# Altium schematic sheet Keyboard.SchDoc
size A3; SheetNumber: 2; SheetTotal: 4
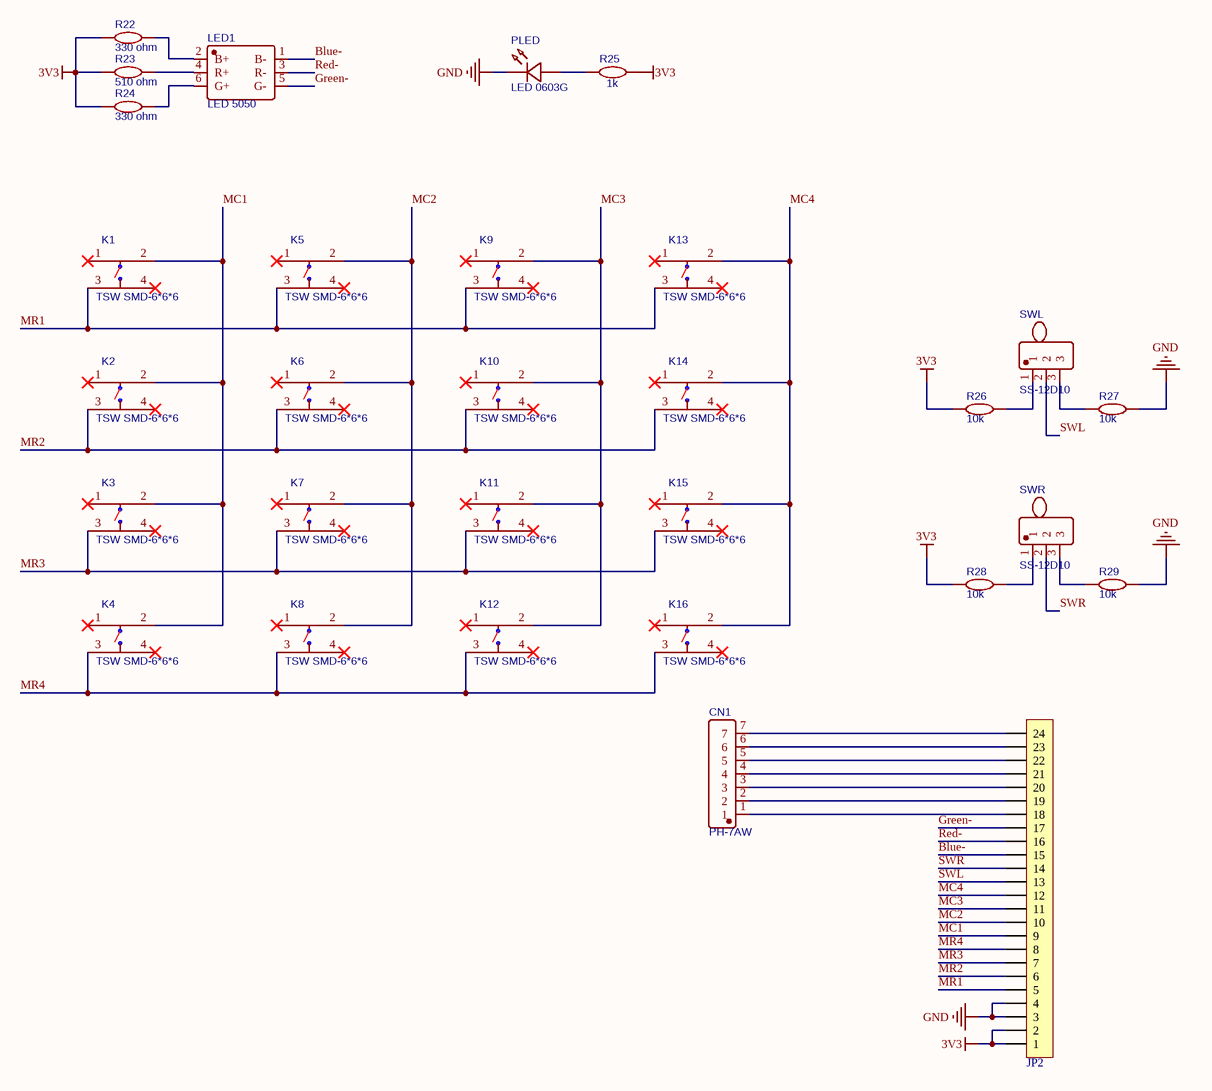
[diagram p0: Keyboard.SchDoc]

## Parts
CN1  PH-7AW  [CONN-TH_PH-7AW]
JP2  FPC1.0-24P  [FPC1.0-2H-WS-24P]  (value not drawn)
K1  TSW SMD-6*6*6  [TSW SMD-6*6*6]
K2  TSW SMD-6*6*6  [TSW SMD-6*6*6]
K3  TSW SMD-6*6*6  [TSW SMD-6*6*6]
K4  TSW SMD-6*6*6  [TSW SMD-6*6*6]
K5  TSW SMD-6*6*6  [TSW SMD-6*6*6]
K6  TSW SMD-6*6*6  [TSW SMD-6*6*6]
K7  TSW SMD-6*6*6  [TSW SMD-6*6*6]
K8  TSW SMD-6*6*6  [TSW SMD-6*6*6]
K9  TSW SMD-6*6*6  [TSW SMD-6*6*6]
K10  TSW SMD-6*6*6  [TSW SMD-6*6*6]
K11  TSW SMD-6*6*6  [TSW SMD-6*6*6]
K12  TSW SMD-6*6*6  [TSW SMD-6*6*6]
K13  TSW SMD-6*6*6  [TSW SMD-6*6*6]
K14  TSW SMD-6*6*6  [TSW SMD-6*6*6]
K15  TSW SMD-6*6*6  [TSW SMD-6*6*6]
K16  TSW SMD-6*6*6  [TSW SMD-6*6*6]
LED1  LED 5050  [LED 5050]
PLED  LED 0603G  [LED 0603G]
R22  330 ohm  [R0603]
R23  510 ohm  [R0603]
R24  330 ohm  [R0603]
R25  1k  [R0603]
R26  10k  [R0603]
R27  10k  [R0603]
R28  10k  [R0603]
R29  10k  [R0603]
SWL  SS-12D10  [SS-12D10]
SWR  SS-12D10  [SS-12D10]

## Nets
3V3: JP2.1 JP2.2 R22.2 R23.2 R24.2 R25.1 R26.1 R28.1
GND: JP2.3 JP2.4 PLED.2(K) R27.2 R29.2
Blue-: JP2.15 LED1.1(B-)
Green-: JP2.17 LED1.5(G-)
MC1: JP2.9 K1.2 K2.2 K3.2 K4.2
MC2: JP2.10 K5.2 K6.2 K7.2 K8.2
MC3: JP2.11 K9.2 K10.2 K11.2 K12.2
MC4: JP2.12 K13.2 K14.2 K15.2 K16.2
MR1: JP2.5 K1.3 K5.3 K9.3 K13.3
MR2: JP2.6 K2.3 K6.3 K10.3 K14.3
MR3: JP2.7 K3.3 K7.3 K11.3 K15.3
MR4: JP2.8 K4.3 K8.3 K12.3 K16.3
Red-: JP2.16 LED1.3(R-)
SWL: JP2.13 SWL.2
SWR: JP2.14 SWR.2
NetCN1_1: CN1.1 JP2.18
NetCN1_2: CN1.2 JP2.19
NetCN1_3: CN1.3 JP2.20
NetCN1_4: CN1.4 JP2.21
NetCN1_5: CN1.5 JP2.22
NetCN1_6: CN1.6 JP2.23
NetCN1_7: CN1.7 JP2.24
NetLED1_2: LED1.2(B+) R22.1
NetLED1_4: LED1.4(R+) R23.1
NetLED1_6: LED1.6(G+) R24.1
NetPLED_1: PLED.1(A) R25.2
NetR26_2: R26.2 SWL.1
NetR27_1: R27.1 SWL.3
NetR28_2: R28.2 SWR.1
NetR29_1: R29.1 SWR.3

Not connected (* = marked no-connect by the designer): K1 1* 4*; K2 1* 4*; K3 1* 4*; K4 1* 4*; K5 1* 4*; K6 1* 4*; K7 1* 4*; K8 1* 4*; K9 1* 4*; K10 1* 4*; K11 1* 4*; K12 1* 4*; K13 1* 4*; K14 1* 4*; K15 1* 4*; K16 1* 4*

## Library data of the parts
CN1 = PH-7AW: BOM_Manufacturer: CAX(创都); Contributor: LCSC; BOM_Supplier: LCSC; BOM_Supplier Part: C722789; BOM_Manufacturer Part: PH-7AW; spicePre: C; spiceSymbolName: PH-7AW_C722789
JP2 = FPC-24P-1.0: FPC连接器; 版权归属: 黎明电子style; BOM名称: FPC连接器; 学习资源: https://lmdzstyle.taobao.com/
K1-K16 = TSW SMD-6*6*6: BOM_Manufacturer: GANGYUAN(港源); BOM_Manufacturer Part: KAN0661-1001B; Contributor: LCSC; BOM_Supplier: LCSC; BOM_Supplier Part: C231715; BOM_JLCPCB Part Class: Extended Part; spicePre: S; spiceSymbolName: KAN0661-1001B
LED1 = LED 5050: 5050RGB-LED; BOM_Manufacturer: EVERLIGHT(台湾亿光); BOM_Manufacturer Part: 11-21/BHC-AQ2S2/2T; Contributor: lcsc; BOM_Supplier: LCSC; BOM_Supplier Part: C3014404; spicePre: L; spiceSymbolName: 11-21/BHC-AQ2S2/2T
PLED = LED 0603G: 绿色0603LED; BOM_Manufacturer: EVERLIGHT(台湾亿光); BOM_Manufacturer Part: 11-21/BHC-AQ2S2/2T; Contributor: lcsc; BOM_Supplier: LCSC; BOM_Supplier Part: C3014404; spicePre: L; spiceSymbolName: 11-21/BHC-AQ2S2/2T
R22-R29 = R0603: BOM_Manufacturer: YAGEO; BOM_Manufacturer Part: SR0603JR-071RL; nameAlias: Resistance (Ohms); Contributor: LCSC; Resistance: 1Ω; BOM_Supplier: LCSC; BOM_Supplier Part: C326890; BOM_JLCPCB Part Class: Extended Part; spicePre: R; spiceSymbolName: SR0603JR-071RL
SWL SWR = SS-12D10: 立式三脚拨动开关; BOM_Manufacturer: Dailywell; BOM_Manufacturer Part: 1MS1T1B1M1QES-5; Contributor: LCSC; BOM_Supplier: LCSC; BOM_Supplier Part: C496154; BOM_JLCPCB Part Class: Extended Part; spicePre: S; spiceSymbolName: 1MS1T1B1M1QES-5